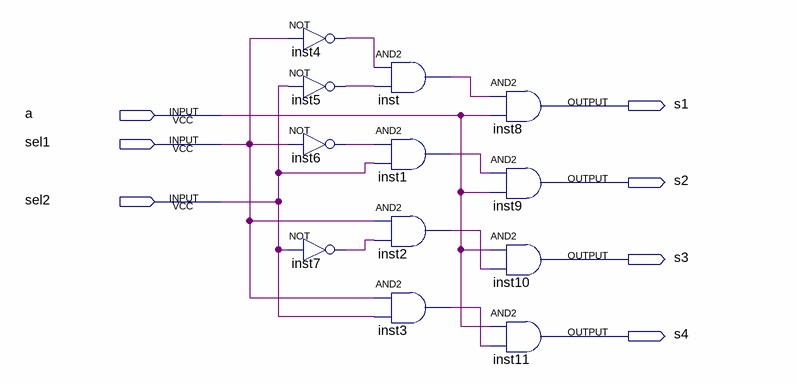
[diagram p0: schematic sheet]
// Quartus schematic demux1x4Block.bdf as structural Verilog: 12 symbols, 7 pins
module demux1x4Block (
  input  a,
  input  sel1,
  input  sel2,
  output s1,
  output s2,
  output s3,
  output s4
);

  wire inst1_out, inst2_out, inst3_out, inst4_out, inst5_out, inst6_out, inst7_out, inst_out;

  not inst4 (inst4_out, sel1);
  not inst5 (inst5_out, sel2);
  not inst6 (inst6_out, sel1);
  not inst7 (inst7_out, sel2);
  and inst (inst_out, inst4_out, inst5_out);
  and inst1 (inst1_out, inst6_out, sel2);
  and inst2 (inst2_out, sel1, inst7_out);
  and inst3 (inst3_out, sel1, sel2);
  and inst8 (s1, inst_out, a);
  and inst9 (s2, inst1_out, a);
  and inst10 (s3, a, inst2_out);
  and inst11 (s4, a, inst3_out);
endmodule
